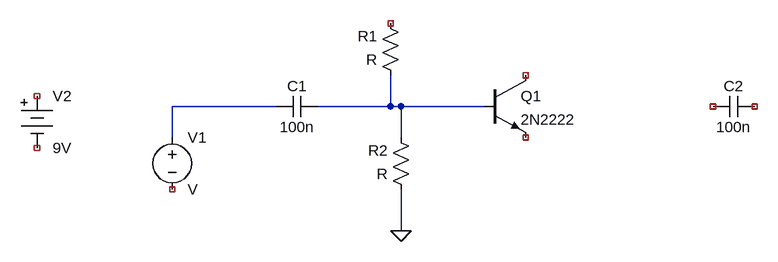
[diagram p0: schematic Draft1.asc]
Draft1.asc, the LTspice schematic file:
Version 4.1
SHEET 1 880 680
WIRE -176 128 -336 128
WIRE 0 128 0 80
WIRE 0 128 -112 128
WIRE 16 128 0 128
WIRE 144 128 16 128
WIRE -336 176 -336 128
WIRE 16 176 16 128
WIRE 16 320 16 256
FLAG 16 320 0
SYMBOL npn 144 80 R0
SYMATTR InstName Q1
SYMATTR Value 2N2222
SYMBOL res 16 96 R180
WINDOW 0 36 76 Left 2
WINDOW 3 36 40 Left 2
SYMATTR InstName R1
SYMBOL res 32 272 R180
WINDOW 0 36 76 Left 2
WINDOW 3 36 40 Left 2
SYMATTR InstName R2
SYMBOL voltage -336 160 R0
SYMATTR InstName V1
SYMBOL Misc\\battery -544 96 R0
WINDOW 123 0 0 Left 0
WINDOW 39 0 0 Left 0
SYMATTR InstName V2
SYMATTR Value 9V
SYMBOL cap -112 112 R90
WINDOW 0 0 32 VBottom 2
WINDOW 3 32 32 VTop 2
SYMATTR InstName C1
SYMATTR Value 100n
SYMBOL cap 560 112 R90
WINDOW 0 0 32 VBottom 2
WINDOW 3 32 32 VTop 2
SYMATTR InstName C2
SYMATTR Value 100n

The netlist it stands for:
* Draft1.asc
Q1 NC_01 N002 NC_02 0 2N2222
R1 N002 NC_03 R
R2 0 N002 R
V1 N001 NC_04 V
V2 NC_05 NC_06 9V
C1 N002 N001 100n
C2 NC_07 NC_08 100n
.model NPN NPN
.model PNP PNP
.lib standard.bjt
.backanno
.end